# Altium schematic sheet LED_array.SchDoc
size A; SheetNumber: 4; SheetTotal: 6
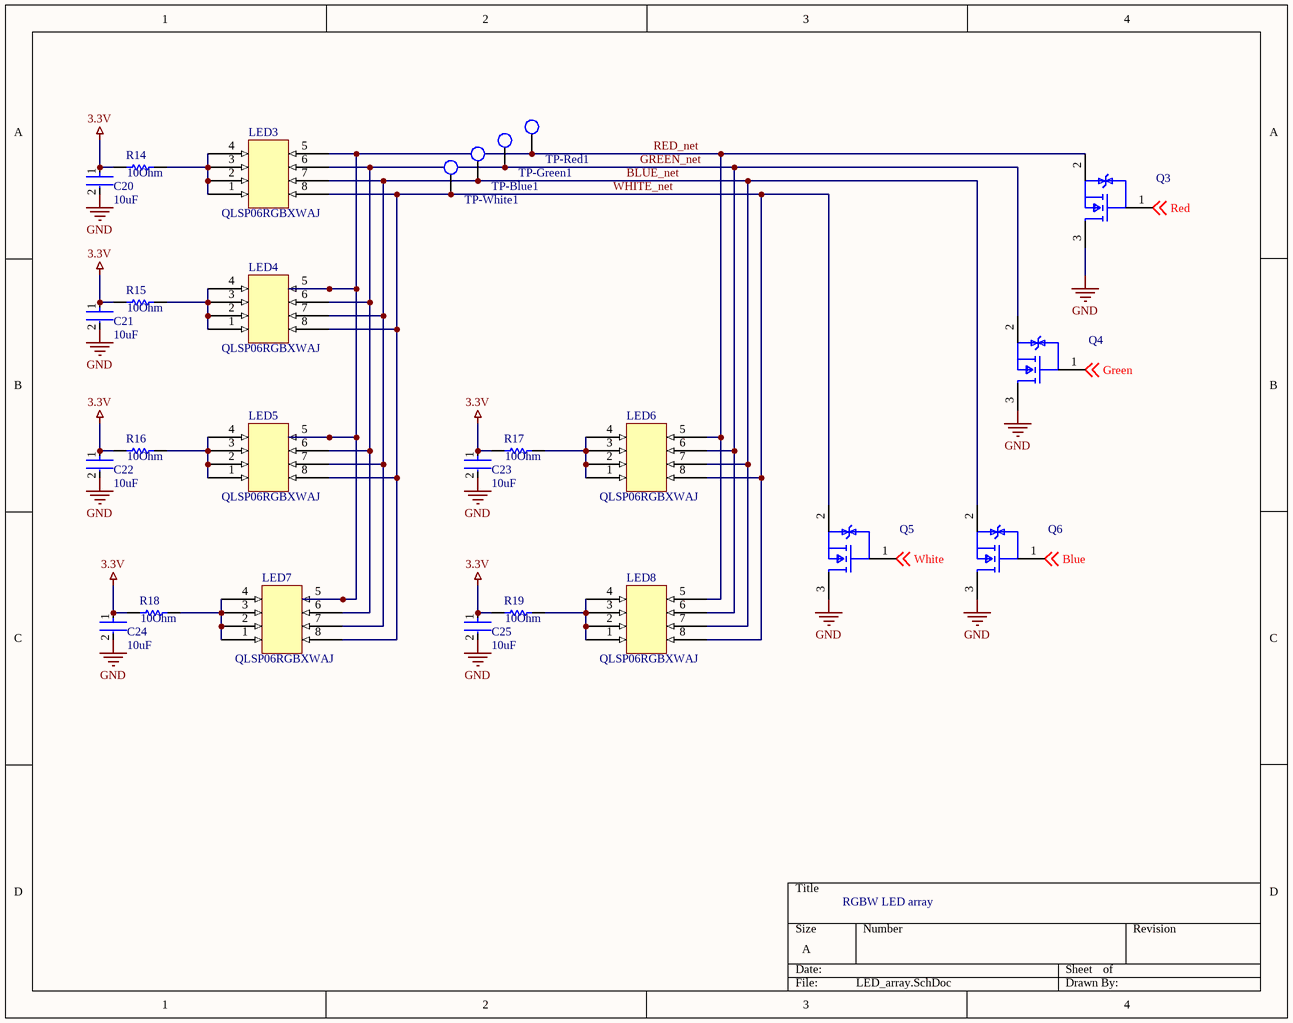
[diagram p0: LED_array.SchDoc]

## Parts
C20  10uF  [FP-C0805C-DG-MFG]
C21  10uF  [FP-C0805C-DG-MFG]
C22  10uF  [FP-C0805C-DG-MFG]
C23  10uF  [FP-C0805C-DG-MFG]
C24  10uF  [FP-C0805C-DG-MFG]
C25  10uF  [FP-C0805C-DG-MFG]
LED3  QLSP06RGBXWAJ  [QLSP06RGBXWAJ]
LED4  QLSP06RGBXWAJ  [QLSP06RGBXWAJ]
LED5  QLSP06RGBXWAJ  [QLSP06RGBXWAJ]
LED6  QLSP06RGBXWAJ  [QLSP06RGBXWAJ]
LED7  QLSP06RGBXWAJ  [QLSP06RGBXWAJ]
LED8  QLSP06RGBXWAJ  [QLSP06RGBXWAJ]
Q3  SSM3K329R,LF  [FP-2-3Z1A-MFG]  (value not drawn)
Q4  SSM3K329R,LF  [FP-2-3Z1A-MFG]  (value not drawn)
Q5  SSM3K329R,LF  [FP-2-3Z1A-MFG]  (value not drawn)
Q6  SSM3K329R,LF  [FP-2-3Z1A-MFG]  (value not drawn)
R14  10Ohm  [RESC2013X50X40ML20T20]
R15  10Ohm  [RESC2013X50X40ML20T20]
R16  10Ohm  [RESC2013X50X40ML20T20]
R17  10Ohm  [RESC2013X50X40ML20T20]
R18  10Ohm  [RESC2013X50X40ML20T20]
R19  10Ohm  [RESC2013X50X40ML20T20]
TP-Blue1  TP_1206  [TP-SMC-1206]  (value not drawn)
TP-Green1  TP_1206  [TP-SMC-1206]  (value not drawn)
TP-Red1  TP_1206  [TP-SMC-1206]  (value not drawn)
TP-White1  TP_1206  [TP-SMC-1206]  (value not drawn)

## Nets
3.3V: C20.1 C21.1 C22.1 C23.1 C24.1 C25.1 R14.1 R15.1 R16.1 R17.1 R18.1 R19.1
GND: C20.2 C21.2 C22.2 C23.2 C24.2 C25.2 Q3.3(DRAIN) Q4.3(DRAIN) Q5.3(DRAIN) Q6.3(DRAIN)
Blue: Q6.1(GATE) ; off-sheet Blue
BLUE_net: LED3.7 LED4.7 LED5.7 LED6.7 LED7.7 LED8.7 Q6.2(SOURCE) TP-Blue1.1
Green: Q4.1(GATE) ; off-sheet Green
GREEN_net: LED3.6 LED4.6 LED5.6 LED6.6 LED7.6 LED8.6 Q4.2(SOURCE) TP-Green1.1
Red: Q3.1(GATE) ; off-sheet Red
RED_net: LED3.5 LED4.5 LED5.5 LED6.5 LED7.5 LED8.5 Q3.2(SOURCE) TP-Red1.1
White: Q5.1(GATE) ; off-sheet White
WHITE_net: LED3.8 LED4.8 LED5.8 LED6.8 LED7.8 LED8.8 Q5.2(SOURCE) TP-White1.1
NetLED3_1: LED3.1 LED3.2 LED3.3 LED3.4 R14.2
NetLED4_1: LED4.1 LED4.2 LED4.3 LED4.4 R15.2
NetLED5_1: LED5.1 LED5.2 LED5.3 LED5.4 R16.2
NetLED6_1: LED6.1 LED6.2 LED6.3 LED6.4 R17.2
NetLED7_1: LED7.1 LED7.2 LED7.3 LED7.4 R18.2
NetLED8_1: LED8.1 LED8.2 LED8.3 LED8.4 R19.2

## Notes on the sheet
- RGBW LED array

## Library data of the parts
C20-C25 = CMP-2007-03243-2: CAP CER 10UF 10V X5R 0805; Manufacturer Part Number: C0805C106K8PACTU; Manufacturer: Kemet; 3DS Part Number: 220-00001; Tolerance: 10%; Temperature Coefficient: 15%; Material: Ceramic; Device Class L2: Capacitors; Device Class L1: Passive Components; ComponentLink2URL: https://content.kemet.com/datasheets/KEM_C1006_X5R_SMD.pdf; Height: 1.4mm; Lead Free: Yes; Digikey Description: CAP CER 10UF 10V X5R 0805; Octopart: https://octopart.com/c0805c106k8pactu-kemet-98697; Capacitance: 10uF; Value: 10uF; Temperature Range Low: -55°C; Temperature: -55°C to +85°C; Automotive: No; Mouser Description: CAP CER 10UF 10V X5R 0805; Ipc Land Pattern Name: CAPC200125X125; Temperature Range High: +85°C; Voltage: 10V; RoHS: TRUE; Device Class L3: Ceramic Capacitors; ComponentLink2Description: Datasheet; Voltage Rating: 10V; Package: C0805C-DG; Temperature Characteristic: X5R; Category: Cap
LED3-LED8 = Component_1
  LED7: ComponentLink1Description: New link; ComponentLink1URL: *; Manufacture Part Number: QLSP06RGBXWAJ
Q3-Q6 = CMP-35916-000013-1: MOSFET N CH 30V 3.5A 2-3Z1A; Gate to Source Voltage (Vgs): 12V; Input Capacitance: 123pF; Drain to Source Resistance: 290mR; Rds On Max: 126mR; Max Power Dissipation: 1W; Continuous Drain Current (ID): 3.5A; Mount: Surface Mount; Case/Package: SOT-23-3; Drain to Source Breakdown Voltage: 30V; Packaging: Tape and Reel; Drain to Source Voltage (Vdss): 30V; Power Dissipation: 1W; Package Quantity: 3000
R14-R19 = CMP-2001-03134-1: Manufacturer: Susumu; Part Number: RL1220S-100-F
TP-Blue1 TP-Green1 TP-Red1 TP-White1 = TP_1206: Test Point SMD 1206; Manufacturer: TE Connectivity (Tyco Electronics); Manufacturer Part Number: 1625854-1; Resistance Value: 0 Ohm; Temperature Coefficient: N/R; Supplier: Digi-Key; Stock 1: 31937; Pricing 1: 1=0.28, 10=0.261, 25=0.224, 50=0.1902, 100=0.1828, 250=0.1641, 500=0.1567, 1000=0.1306 (USD); Case Size: 1206; Dimension: 3.2 x 1.6 x 1.25mm; Family: RC; Mounting: Surface Mount; Operating Temperature: -55 to 125 C; Part No: 1625854-1; RoHS: Yes; Packaging: Tape and Reel; Termination Style: N/R; Terminal Pitch: N/R; Power Rating: N/R; Tolerance: N/R; ComponentLink1URL: https://datasheet.ciiva.com/6439/eng-ds-1773266-a-6439169.pdf; ComponentLink1Description: https://datasheet.ciiva.com/6439/eng-ds-1773266-a-6439169.pdf; ComponentLink2URL: https://datasheet.ciiva.com/30136/1773266-a-30136341.pdf; ComponentLink2Description: https://datasheet.ciiva.com/30136/1773266-a-30136341.pdf; ComponentLink3URL: https://datasheet.ciiva.com/6439/eng-ds-1773266-a-6439080.pdf; ComponentLink3Description: https://datasheet.ciiva.com/6439/eng-ds-1773266-a-6439080.pdf; ComponentLink4URL: https://datasheet.ciiva.com/6439/eng-ds-1773266-a-6439081.pdf; ComponentLink4Description: https://datasheet.ciiva.com/6439/eng-ds-1773266-a-6439081.pdf; ComponentLink5URL: https://datasheet.ciiva.com/6439/eng-ds-1773266-a-6439083.pdf; ComponentLink5Description: https://datasheet.ciiva.com/6439/eng-ds-1773266-a-6439083.pdf; Supplier Part Number: A106143CT-ND